# EAGLE design sensorboard_lightning_rev0 (EAGLE 6.5.0)
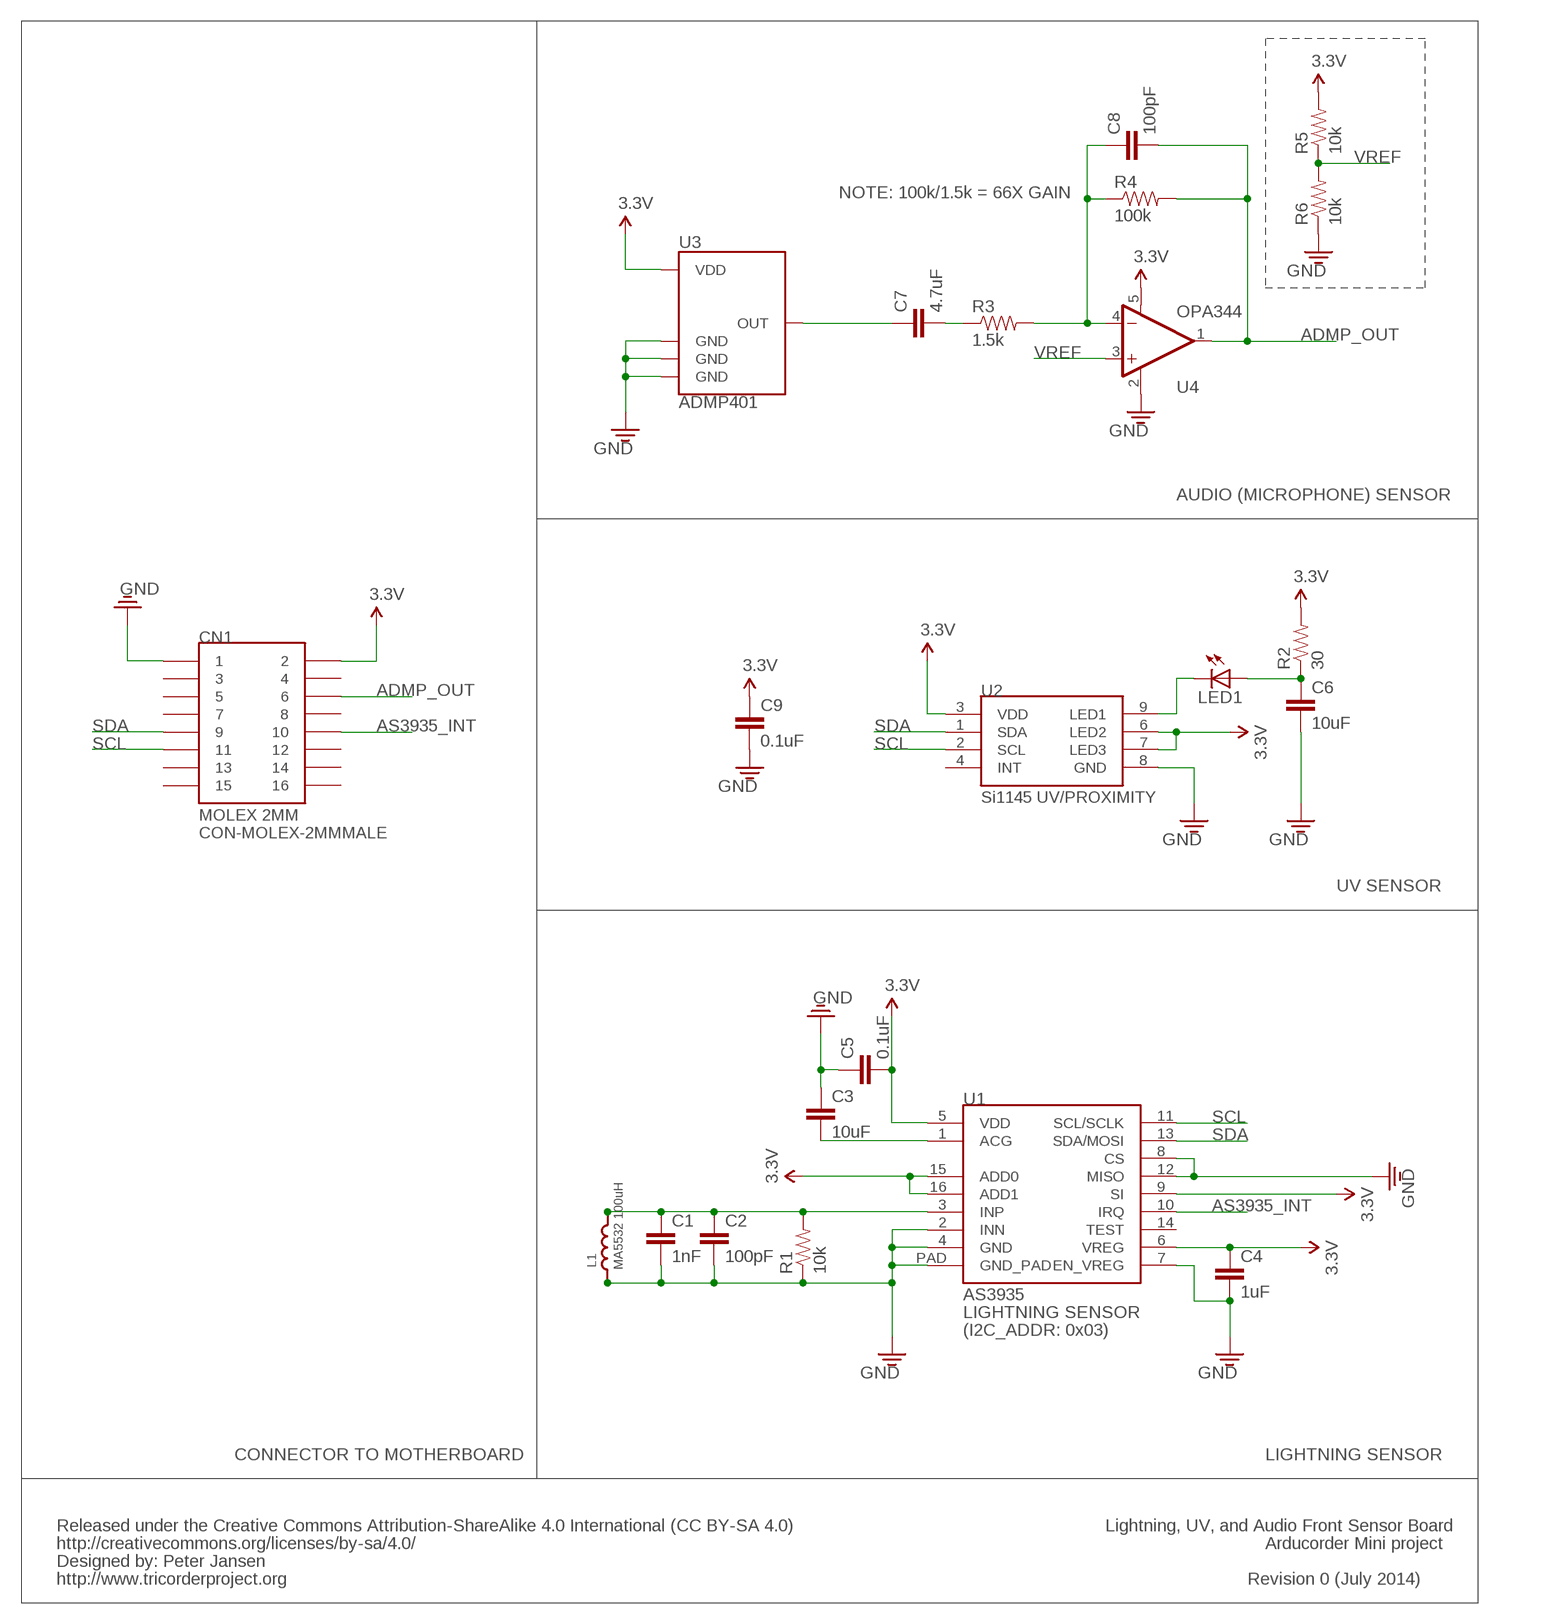
[diagram p0: schematic, sheet 1]

## Parts
C1  1nF  CAP0603  [0603]
C2  100pF  CAP0603  [0603]
C3  10uF  CAP0603  [0603]
C4  1uF  CAP0603  [0603]
C5  0.1uF  CAP0603  [0603]
C6  10uF  CAP0603  [0603]
C7  4.7uF  CAP0603  [0603]
C8  100pF  CAP0603  [0603]
C9  0.1uF  CAP0603  [0603]
CN1  CON-MOLEX-2MMMALE  [MOLEX-0877591650]
L1  MA5532 100uH  INDUCTOR  [MA5532-AE]
LED1  LED1206  [LED-1206]
R1  10k  RESISTOR0603  [0603]
R2  30  RESISTOR0603  [0603]
R3  1.5k  RESISTOR0603  [0603]
R4  100k  RESISTOR0603  [0603]
R5  10k  RESISTOR0603  [0603]
R6  10k  RESISTOR0603  [0603]
U1  AS3935  [16LD_MLPQ-(4X4MM)]
U2  SI1145  [SI1145]
U3  ADMP401  [ADMP401]
U4  OPA344  [SOT23-5]

## Nets
3.3V: C4.1 C5.2 C9.1 CN1.2 R2.2 R5.2 U1.5(VDD) U1.6(VREG) U1.9(SI) U1.15(ADD0) U1.16(ADD1) U2.3(VDD) U2.6(LED2) U2.7(LED3) U3.5(VDD) U4.5(V+)
ADMP_OUT: C8.2 CN1.6 R4.2 U4.1(OUT)
AS3935_INT: CN1.10 U1.10(IRQ)
GND: C1.2 C2.2 C3.1 C4.2 C5.1 C6.2 C9.2 CN1.1 L1.2 R1.1 R6.1 U1.2(INN) U1.4(GND) U1.7(EN_VREG) U1.8(CS) U1.12(MISO) U1.PAD(GND_PAD) U2.8(GND) U3.2(GND) U3.4(GND) U3.6(GND) U4.2(V-)
N$1: LED1.C U2.9(LED1)
N$2: C3.2 U1.1(ACG)
N$3: C6.1 LED1.A R2.1
N$11: C1.1 C2.1 L1.1 R1.2 U1.3(INP)
N$51: C7.2 R3.1
N$52: C8.1 R3.2 R4.1 U4.4(-IN)
N$55: C7.1 U3.1(OUT)
SCL: CN1.11 U1.11(SCL/SCLK) U2.2(SCL)
SDA: CN1.9 U1.13(SDA/MOSI) U2.1(SDA)
VREF: R5.1 R6.2 U4.3(+IN)
Unconnected: CN1.3 CN1.4 CN1.5 CN1.7 CN1.8 CN1.12 CN1.13 CN1.14 CN1.15 CN1.16 U1.14(TEST) U2.4(INT)

## Notes on the sheet
- NOTE: 100k/1.5k = 66X GAIN
- AUDIO (MICROPHONE) SENSOR
- UV SENSOR
- (I2C_ADDR: 0x03)
- CONNECTOR TO MOTHERBOARD | LIGHTNING SENSOR
- Released under the Creative Commons Attribution-ShareAlike 4.0 International (CC BY-SA 4.0) | Lightning, UV, and Audio Front Sensor Board
- http://creativecommons.org/licenses/by-sa/4.0/ | Arducorder Mini project
- Designed by: Peter Jansen
- http://www.tricorderproject.org | Revision 0 (July 2014)

## Library data of the parts
C1-C6 C9 = notes_mark5:CAP: Capacitor Standard 0603 ceramic capacitor, and 0.1" leaded capacitor.
C7 C8 = notes_mark5a:CAP: Capacitor Standard 0603 ceramic capacitor, and 0.1" leaded capacitor.
CN1 = notes-arducorder-mini:CON-MOLEX-2MM: Molex 2mm pitch connectors. (87368-1624, 0877591650)
L1 = notes_mark5:INDUCTOR
LED1 = SparkFun-LED:LED: LEDs Standard schematic elements and footprints for 5mm, 3mm, 1206, and 0603 sized LEDs. 5mm - Spark Fun Electronics SKU : COM-00529 (and others)
R1 R2 = notes_mark5:RESISTOR: Resistor Basic schematic elements and footprints for 0603, 1206, and PTH 1/10th watt (small) resistors.
R3-R6 = notes_mark5a:RESISTOR: Resistor Basic schematic elements and footprints for 0603, 1206, and PTH 1/10th watt (small) resistors.
U1 = notes_mark5:AS3935: Australia Micro Systems AS3935 Franklin Lightning Sensor IC
U2 = notes-arducorder-mini:SI1145: Silicon Labs Si1145/46/47 Proximity/UV/Ambient light sensor w/I2C interface
U3 = SparkFun-Sensors:ADMP401: Omnidirection bottom-port MEMS microphone
U4 = SparkFun-AnalogIC:OPA344: Single gate rail-to-rail output op-amp. Inputs extend 300mV past rails.

## Net classes
1 supply: width 0.178 mm
3 usbvcc: width 0.61 mm, drill 0.508 mm, clearance 0.203 mm to class 0, clearance 0.254 mm
5 USB: width 0.14 mm

## Board
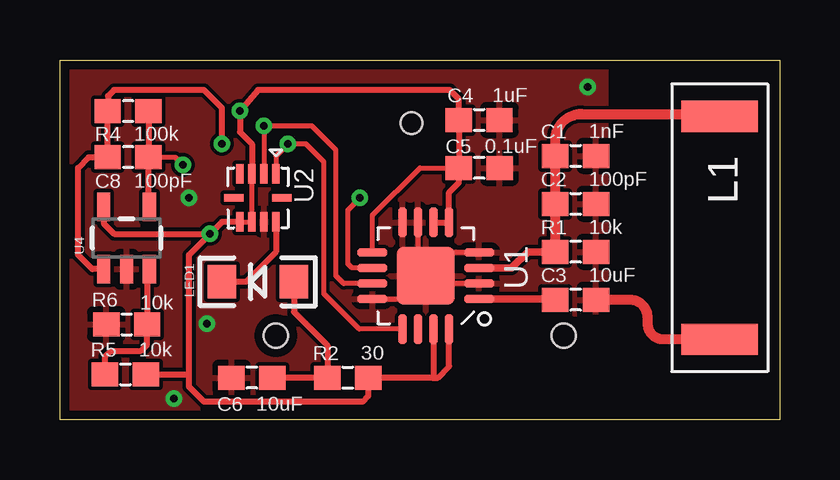
[diagram p1: board, top side]
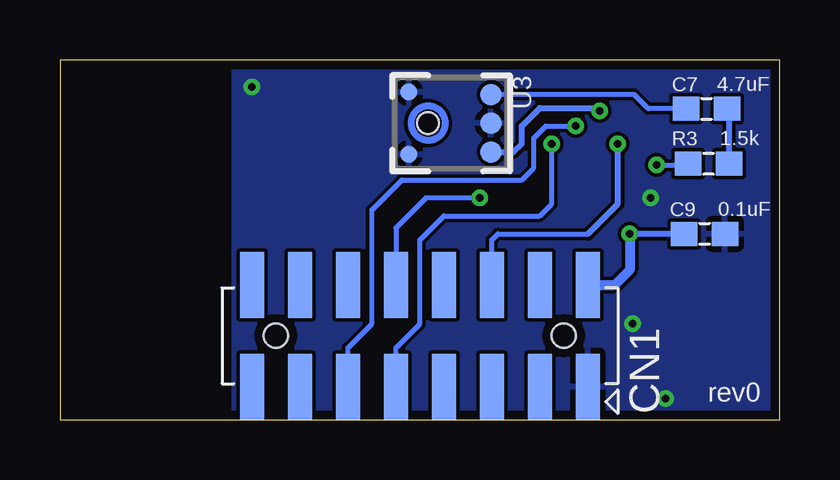
[diagram p2: board, bottom side, seen from below]

Size 30 x 15 mm. Coordinates in mm from the lower left corner, seen from the top.
Outline: 0,0 0,15 30,15 30,0 0,0
Copper layers (1*16): Top 0.0356mm / dielectric 1.5011mm / Bottom 0.0356mm
Design rules "default": minimum track width 6mil, minimum drill 13mil, track to track 6mil, track to pad 6mil, pad to pad 6mil, via to via 6mil, smd to smd 6mil, copper to edge 15mil, drill to drill 6mil, minimum pad ring 7mil, minimum via ring 7mil, stop-mask expansion 3mil, vias tented up to drill 0mil, thermal gap 10mil
tRestrict: area 22.9,0 to 30,15; area 21.6,4 to 22.9,4.4
bRestrict: area 22.9,0 to 30,15

### Footprints (pad centres in the part's own frame; a part is rotated, then mirrored left to right if it is on the bottom)
0603 = smd 1.1 x 1: 1 -0.85,0; 2 0.85,0
MOLEX-0877591650 = smd 1 x 2.75: 1 7,-2.125; 2 7,2.125; 3 5,-2.125; 4 5,2.125; 5 3,-2.125; 6 3,2.125; 7 1,-2.125; 8 1,2.125; 9 -1,-2.125; 10 -1,2.125; 11 -3,-2.125; 12 -3,2.125; 13 -5,-2.125; 14 -5,2.125; 15 -7,-2.125; 16 -7,2.125 | hole 1: -6,0; 6,0
MA5532-AE = smd 1.3 x 3.2: 1 -4.65,0; 2 4.65,0
LED-1206 = smd 1.2 x 1.4: A -1.5,0; C 1.5,0
16LD_MLPQ-(4X4MM) = smd 1.25 x 0.35: 1 -2.225,0.975; 2 -2.225,0.325; 3 -2.225,-0.325; 4 -2.225,-0.975; 9 2.225,-0.975; 10 2.225,-0.325; 11 2.225,0.325; 12 2.225,0.975 | smd 0.35 x 1.25: 5 -0.975,-2.225; 6 -0.325,-2.225; 7 0.325,-2.225; 8 0.975,-2.225; 13 0.975,2.225; 14 0.325,2.225; 15 -0.325,2.225; 16 -0.975,2.225 | smd 2.4 x 2.4: PAD 0,0
SI1145 = smd 0.8 x 0.3: 1 -1,0.75; 2 -1,0.25; 3 -1,-0.25; 4 -1,-0.75; 6 1,-0.75; 7 1,-0.25; 8 1,0.25; 9 1,0.75 | smd 0.3 x 0.8: 5 0,-1; 10 0,1
ADMP401 = smd 0.9 x 0.9: 1 -1.2,2.62; 5 1.2,2.62; 6 0,2.62 | smd 0.7 x 0.7: 2 1.3,-0.8; 4 -1.3,-0.8 | hole 0.9: 0,0
SOT23-5 = smd 0.55 x 1.2: 1 -0.95,-1.3; 2 0,-1.3; 3 0.95,-1.3; 4 0.95,1.3; 5 -0.95,1.3

### Placement (x,y rotation side)
C1  21.5,11 0 top
C2  21.5,9 0 top
C3  21.5,5 180 top
C4  17.47,12.5 0 top
C5  17.48,10.5 180 top
C6  8,1.75 180 top
C7  3.04,12.96 0 bottom
C8  2.84,10.95 180 top
C9  3.12,7.75 0 bottom
CN1  15,3.5 0 bottom
L1  27.5,8 270 top
LED1  8.25,5.75 180 top
R1  21.5,7 180 top
R2  12,1.75 0 top
R3  2.96,10.67 180 bottom
R4  2.84,12.86 180 top
R5  2.73,1.89 0 top
R6  2.78,3.97 0 top
U1  15.25,6 180 top
U2  8.25,9.25 270 top
U3  14.65,12.36 270 bottom
U4  2.78,7.57 0 top

### Tracks (layer width: path | path; a pad name or v marks a point on that pad's centre or on a via)
3.3V  (via drill 0.33)
  Top 0.203: U2.6 U2.7 U2.3 | U1.9 13.02,8.52 15,10.5 C5.2
  Top 0.254: U1.6 U1.5 16.23,9.48 16.63,9.88 C5.2 | C5.2 | C4.1 | U4.5 1.83,8.17 2.25,7.75 v6.25,7.75 | U2.6 6.75,8.25 v6.25,7.75 | U2.3 8,11.5 7.5,12 v7.5,12.88 8.25,13.75 16.25,13.75 16.63,13.37 C4.1 | C4.1 C5.2 | 5.38,1.88 5.38,1.38 6,0.75 12.62,0.75 12.85,0.97 R2.2 15.5,1.75 | 5.38,1.88 5.38,6.88 v6.25,7.75 | 15.5,1.75 15.75,1.75 16.23,2.22 U1.16 | U1.15 15.57,1.82 arc-90 15.5,1.75 | R5.2 5.36,1.89 5.38,1.88
  Bottom 0.254: U3.5 11.09,11.16 10.75,11.5 10.75,12.25 10,13 7.62,13 v7.5,12.88 | C9.1 v6.25,7.75
  Bottom 0.406: CN1.2 6.88,5.62 6.25,6.25 v6.25,7.75
ADMP_OUT  (via drill 0.33)
  Top 0.254: U4.1 1.35,6.27 0.75,6.88 0.75,10.5 1.2,10.95 C8.2 R4.2 2,13.5 2.25,13.75 6,13.75 6.75,13 v6.75,11.5
  Bottom 0.203: CN1.6 12,7.5 11.75,7.75 8,7.75
  Bottom 0.254: 8,7.75 6.75,9 v6.75,11.5
AS3935_INT  (via drill 0.33)
  Top 0.203: U1.10 12.18,6.32 12,6.5 12,8.75 v12.5,9.25
  Bottom 0.203: v12.5,9.25 14.75,9.25 16,8 CN1.10
GND  (via drill 0.33)
  Top 0.203: U1.12 14.27,5.03 U1.PAD | U1.7 14.93,6.32 U1.PAD | U1.2 15.57,5.68 U1.PAD | U1.4 16.23,6.98 U1.PAD
  Top 0.406: L1.2 25.15,3.35 arc-90 24.5,4 24.5,4.25 arc90 23.75,5 C3.1
  other vias: 6.12,4 4.75,0.88 22,13.88 5.38,9.25
  pour Top: 0,15 0,0 30,0 30,15
  pour Bottom: 0,0 0,15 30,15 30,0
N$1
  Top 0.254: U2.9 9,7 7.75,5.75 LED1.C
N$2
  Top 0.305: U1.1 20.62,5.03 C3.2
N$3
  Top 0.254: LED1.A 9.75,4.5 11.15,3.1 R2.1 C6.1
N$11
  Top 0.254: 20.65,6.82 R1.2
  Top 0.305: U1.3 18.82,6.32 19.5,7 R1.2
  Top 0.406: R1.2 C2.1 C1.1 20.65,11.65 arc-90 21.75,12.75 27.4,12.75 L1.1
N$51
  Bottom 0.254: C7.2 2.11,12.88 R3.1
N$52  (via drill 0.33)
  Top 0.203: C8.1 4.8,10.95 v5.12,10.62
  Top 0.254: U4.4 3.69,8.91 C8.1 R4.1
  Bottom 0.203: v5.12,10.62 3.85,10.62 R3.2
N$55
  Bottom 0.203: C7.1 5.46,12.96 6.06,13.56 U3.1
SCL  (via drill 0.33)
  Top 0.203: U1.11 11.82,5.68 11.5,6 11.5,11.25 10.5,12.25 v8.5,12.25 U2.2
  Bottom 0.203: CN1.11 18,3 17,4 17,8.75 15.75,10 10.75,10 10.25,10.5 10.25,11.75 9.75,12.25 v8.5,12.25
SDA  (via drill 0.33)
  Top 0.203: U1.13 12.48,3.78 11,5.25 11,10.75 10.25,11.5 v9.5,11.5 9,11 U2.1
  Bottom 0.203: CN1.9 16,3 15,4 15,7.5 14,8.5 10,8.5 9.5,9 v9.5,11.5
VREF
  Top 0.254: U4.3 3.63,6.18 R6.2 3.62,3.12 3.38,2.88 2.12,2.88 1.88,2.63 R5.1

### Text on the board
bPlace: rev0